# Altium schematic sheet 14_PHY_FE_41-48.SchDoc
size 419 x 296 mm; Author: Serbinov O.A.; CompanyName: ELSICOM; DrawnBy: Serbinov O.A.; Engineer: Serbinov O.A.; Organization: Elsicom; Address1: Kirova avenue, 58; Address2: Tomsk; Address3: Russia 634012; DocumentNumber: 15; SheetNumber: 15; SheetTotal: 44; ProjectName: 48_PORTS
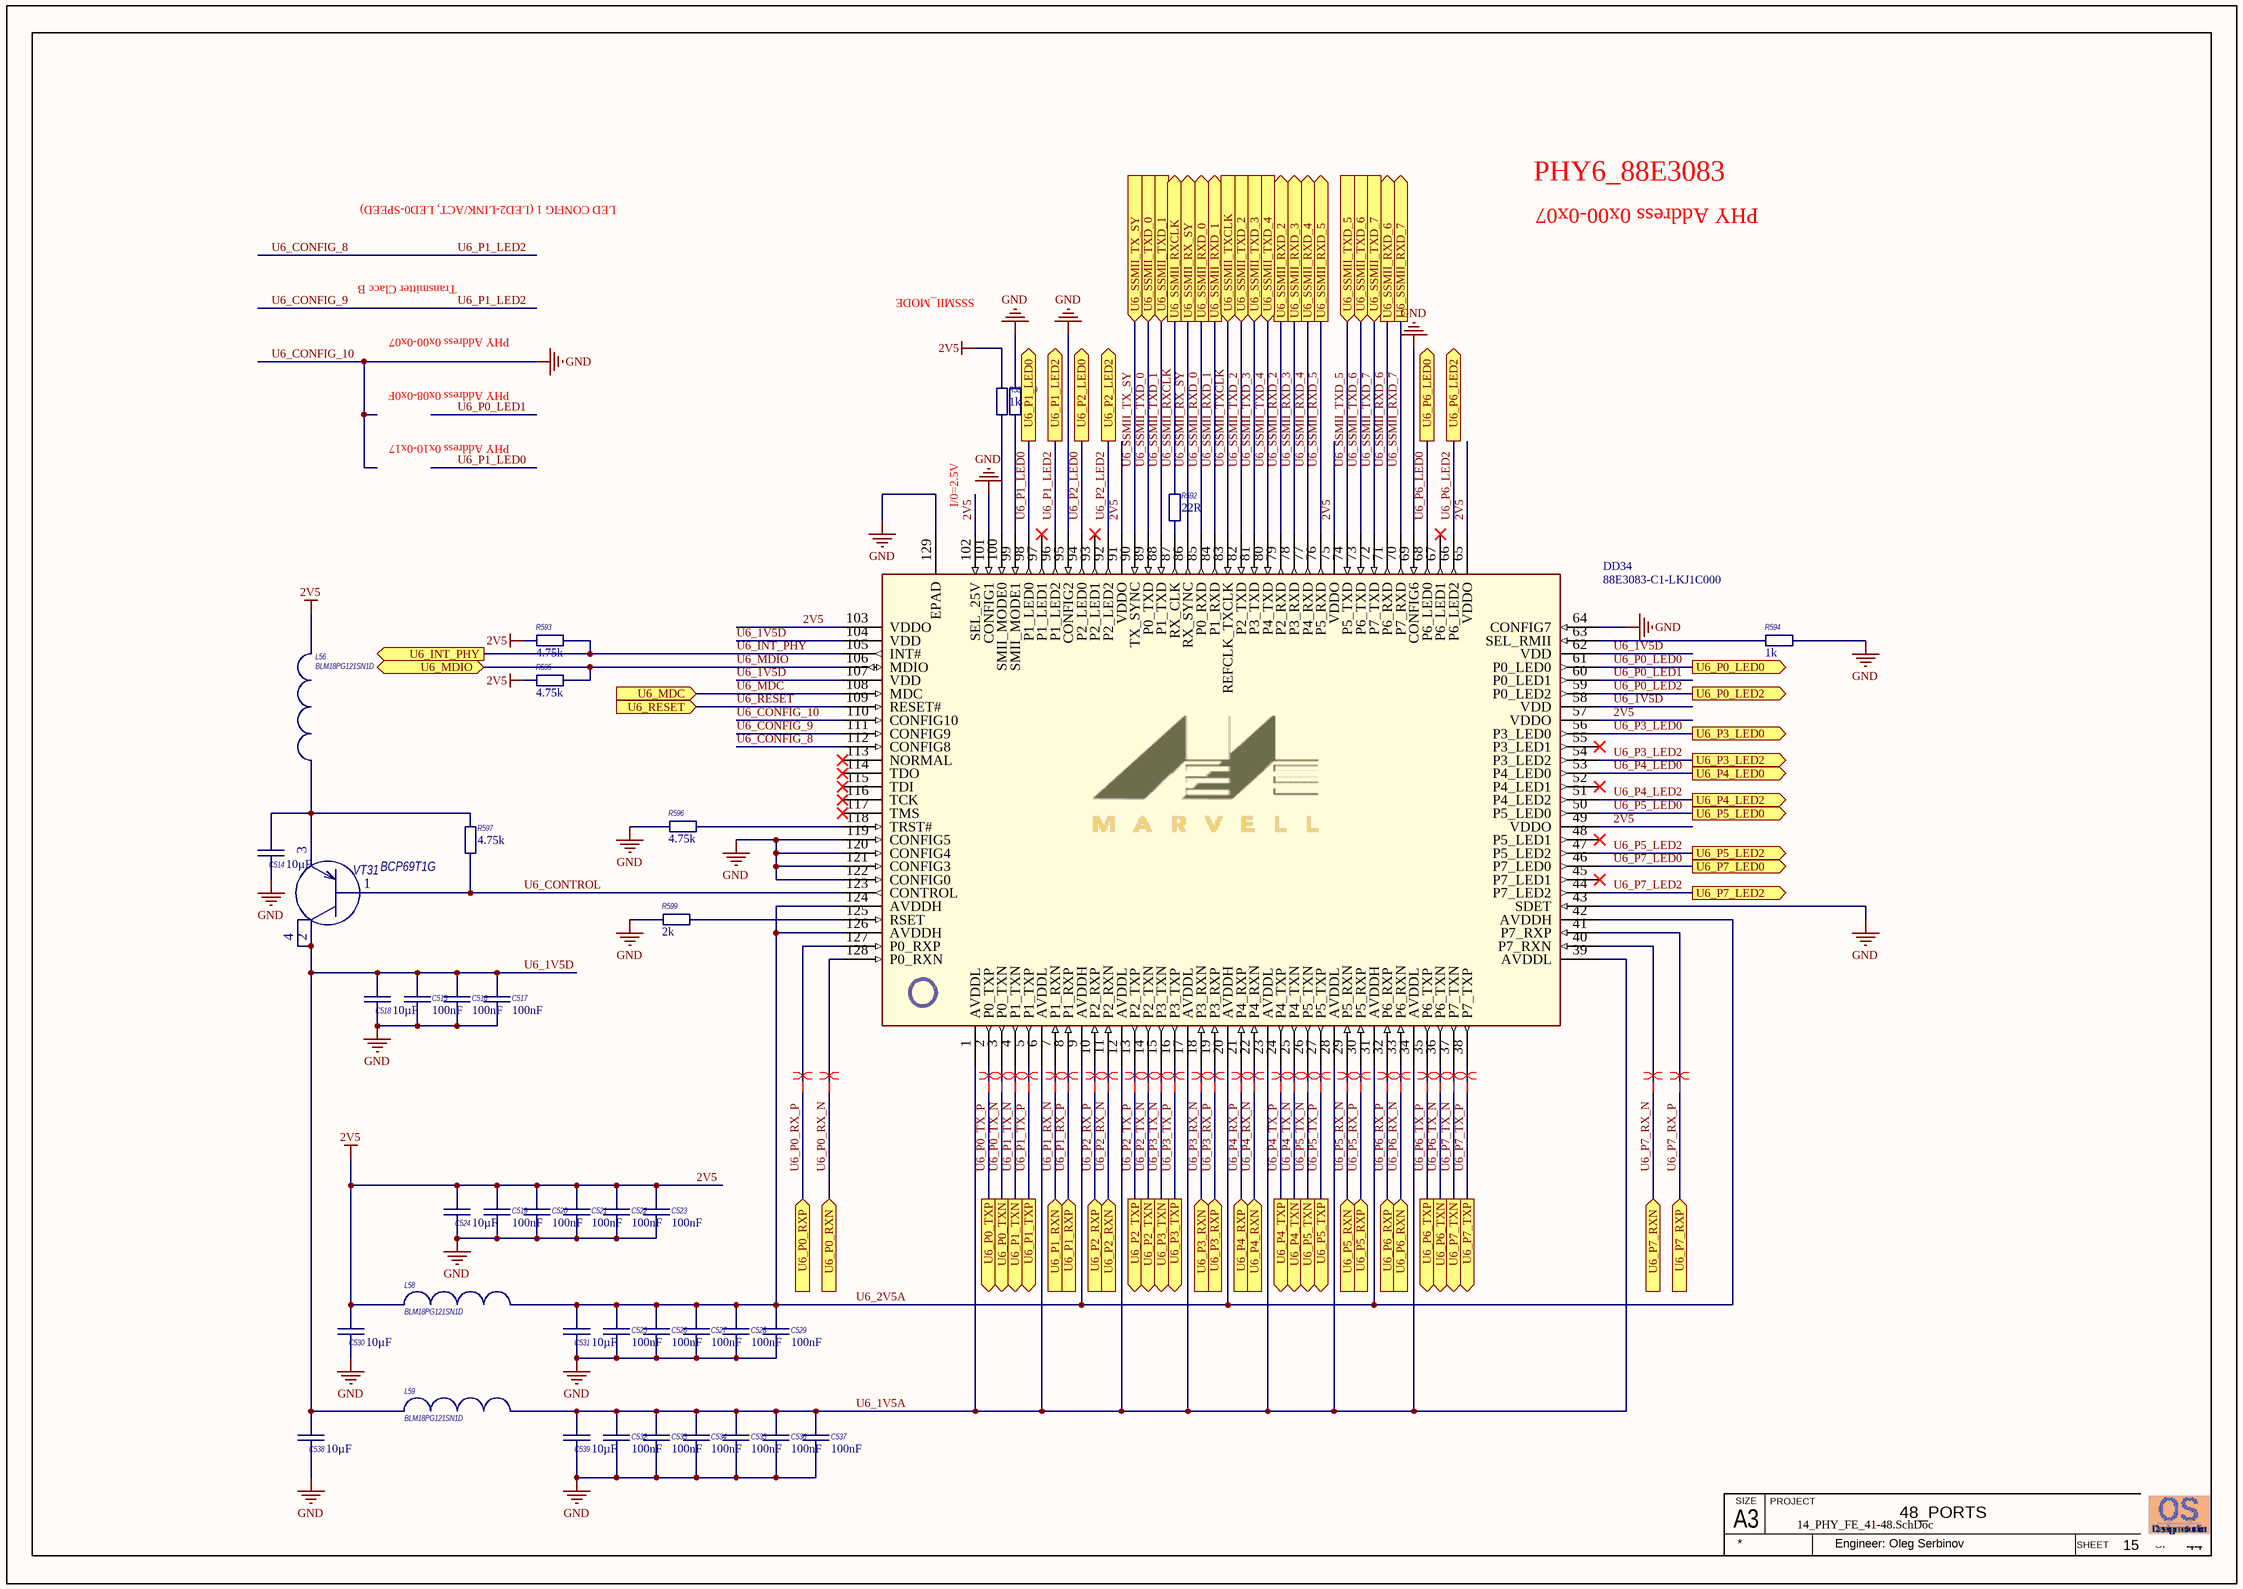
[diagram p0: 14_PHY_FE_41-48.SchDoc]

## Parts
C514  Capacitance: 10µF  [CAPC2012[0805]]  (hidden comment: GRM21BR61C106KE15)
C515  Capacitance: 100nF  [C0402_IPC High Density]  (hidden comment: GRM155R71E104KE14D)
C516  Capacitance: 100nF  [C0402_IPC High Density]  (hidden comment: GRM155R71E104KE14D)
C517  Capacitance: 100nF  [C0402_IPC High Density]  (hidden comment: GRM155R71E104KE14D)
C518  Capacitance: 10µF  [CAPC2012[0805]]  (hidden comment: GRM21BR61C106KE15)
C519  Capacitance: 100nF  [C0402_IPC High Density]  (hidden comment: GRM155R71E104KE14D)
C520  Capacitance: 100nF  [C0402_IPC High Density]  (hidden comment: GRM155R71E104KE14D)
C521  Capacitance: 100nF  [C0402_IPC High Density]  (hidden comment: GRM155R71E104KE14D)
C522  Capacitance: 100nF  [C0402_IPC High Density]  (hidden comment: GRM155R71E104KE14D)
C523  Capacitance: 100nF  [C0402_IPC High Density]  (hidden comment: GRM155R71E104KE14D)
C524  Capacitance: 10µF  [CAPC2012[0805]]  (hidden comment: GRM21BR61C106KE15)
C525  Capacitance: 100nF  [C0402_IPC High Density]  (hidden comment: GRM155R71E104KE14D)
C526  Capacitance: 100nF  [C0402_IPC High Density]  (hidden comment: GRM155R71E104KE14D)
C527  Capacitance: 100nF  [C0402_IPC High Density]  (hidden comment: GRM155R71E104KE14D)
C528  Capacitance: 100nF  [C0402_IPC High Density]  (hidden comment: GRM155R71E104KE14D)
C529  Capacitance: 100nF  [C0402_IPC High Density]  (hidden comment: GRM155R71E104KE14D)
C530  Capacitance: 10µF  [CAPC2012[0805]]  (hidden comment: GRM21BR61C106KE15)
C531  Capacitance: 10µF  [CAPC2012[0805]]  (hidden comment: GRM21BR61C106KE15)
C532  Capacitance: 100nF  [C0402_IPC High Density]  (hidden comment: GRM155R71E104KE14D)
C533  Capacitance: 100nF  [C0402_IPC High Density]  (hidden comment: GRM155R71E104KE14D)
C534  Capacitance: 100nF  [C0402_IPC High Density]  (hidden comment: GRM155R71E104KE14D)
C535  Capacitance: 100nF  [C0402_IPC High Density]  (hidden comment: GRM155R71E104KE14D)
C536  Capacitance: 100nF  [C0402_IPC High Density]  (hidden comment: GRM155R71E104KE14D)
C537  Capacitance: 100nF  [C0402_IPC High Density]  (hidden comment: GRM155R71E104KE14D)
C538  Capacitance: 10µF  [CAPC2012[0805]]  (hidden comment: GRM21BR61C106KE15)
C539  Capacitance: 10µF  [CAPC2012[0805]]  (hidden comment: GRM21BR61C106KE15)
DD34  88E3083-C1-LKJ1C000  [LQFP-128N]
L56  BLM18PG121SN1D  [INDC1608X95N]
L58  BLM18PG121SN1D  [INDC1608X95N]
L59  BLM18PG121SN1D  [INDC1608X95N]
R588  Resistance: 1k  [R0402_IPC High Density]  (hidden comment: ERJ-2RKF1001X)
R589  Resistance: 1k  [R0402_IPC High Density]  (hidden comment: ERJ-2RKF1001X)
R592  Resistance: 22R  [R0402_IPC High Density]  (hidden comment: ERJ-2RKF22R0X)
R593  Resistance (Ohms): 4.75k  [R0402_IPC High Density]  (hidden comment: ERJ-2RKF4751X)
R594  Resistance: 1k  [R0402_IPC High Density]  (hidden comment: ERJ-2RKF1001X)
R595  Resistance (Ohms): 4.75k  [R0402_IPC High Density]  (hidden comment: ERJ-2RKF4751X)
R596  Resistance (Ohms): 4.75k  [R0402_IPC High Density]  (hidden comment: ERJ-2RKF4751X)
R597  Resistance (Ohms): 4.75k  [R0402_IPC High Density]  (hidden comment: ERJ-2RKF4751X)
R599  Resistance (Ohms): 2k  [R0402_IPC High Density]  (hidden comment: ERJ-2RKF2001X)
VT31  BCP69T1G  [SOT223_N]

## Ports
U6_INT_PHY (out), U6_MDC (in), U6_MDIO (bidir), U6_P0_LED0 (out), U6_P0_LED2 (out), U6_P0_RXN (in), U6_P0_RXP (in), U6_P0_TXN (out), U6_P0_TXP (out), U6_P1_LED0 (out), U6_P1_LED2 (out), U6_P1_RXN (in), U6_P1_RXP (in), U6_P1_TXN (out), U6_P1_TXP (out), U6_P2_LED0 (out), U6_P2_LED2 (out), U6_P2_RXN (in), U6_P2_RXP (in), U6_P2_TXN (out), U6_P2_TXP (out), U6_P3_LED0 (out), U6_P3_LED2 (out), U6_P3_RXN (in), U6_P3_RXP (in), U6_P3_TXN (out), U6_P3_TXP (out), U6_P4_LED0 (out), U6_P4_LED2 (out), U6_P4_RXN (in), U6_P4_RXP (in), U6_P4_TXN (out), U6_P4_TXP (out), U6_P5_LED0 (out), U6_P5_LED2 (out), U6_P5_RXN (in), U6_P5_RXP (in), U6_P5_TXN (out), U6_P5_TXP (out), U6_P6_LED0 (out), U6_P6_LED2 (out), U6_P6_RXN (in), U6_P6_RXP (in), U6_P6_TXN (out), U6_P6_TXP (out), U6_P7_LED0 (out), U6_P7_LED2 (out), U6_P7_RXN (in), U6_P7_RXP (in), U6_P7_TXN (out), U6_P7_TXP (out), U6_RESET (in), U6_SSMII_RX_SY (out), U6_SSMII_RXCLK (out), U6_SSMII_RXD_0 (out), U6_SSMII_RXD_1 (out), U6_SSMII_RXD_2 (out), U6_SSMII_RXD_3 (out), U6_SSMII_RXD_4 (out), U6_SSMII_RXD_5 (out), U6_SSMII_RXD_6 (out), U6_SSMII_RXD_7 (out), U6_SSMII_TX_SY (in), U6_SSMII_TXCLK (in), U6_SSMII_TXD_0 (in), U6_SSMII_TXD_1 (in), U6_SSMII_TXD_2 (in), U6_SSMII_TXD_3 (in), U6_SSMII_TXD_4 (in), U6_SSMII_TXD_5 (in), U6_SSMII_TXD_6 (in), U6_SSMII_TXD_7 (in)

## Nets
2V5: C519.2 C520.2 C521.2 C522.2 C523.2 C524.2 C530.2 DD34.49(VDDO) DD34.57(VDDO) DD34.65(VDDO) DD34.75(VDDO) DD34.91(VDDO) DD34.102(SEL_25V) DD34.103(VDDO) L56.2 L58.1 R588.2 R593.1 R595.1
U6_CONFIG_10: C514.1 C515.1 C516.1 C517.1 C518.1 C519.1 C520.1 C521.1 C522.1 C523.1 C524.1 C525.1 C526.1 C527.1 C528.1 C529.1 C530.1 C531.1 C532.1 C533.1 C534.1 C535.1 C536.1 C537.1 C538.1 C539.1 DD34.43(SDET) DD34.64(CONFIG7) DD34.69(CONFIG6) DD34.95(CONFIG2) DD34.101(CONFIG1) DD34.110(CONFIG10) DD34.119(CONFIG5) DD34.120(CONFIG4) DD34.121(CONFIG3) DD34.122(CONFIG0) DD34.129(EPAD) R589.2 R594.1 R596.1 R599.1  [also labelled GND]
U6_1V5A: C532.2 C533.2 C534.2 C535.2 C536.2 C537.2 C539.2 DD34.1(AVDDL) DD34.6(AVDDL) DD34.12(AVDDL) DD34.17(AVDDL) DD34.23(AVDDL) DD34.28(AVDDL) DD34.34(AVDDL) DD34.39(AVDDL) L59.2
U6_1V5D: C515.2 C516.2 C517.2 C518.2 C538.2 DD34.58(VDD) DD34.62(VDD) DD34.104(VDD) DD34.107(VDD) L59.1 VT31.2(K) VT31.4(K)
U6_2V5A: C525.2 C526.2 C527.2 C528.2 C529.2 C531.2 DD34.9(AVDDH) DD34.20(AVDDH) DD34.31(AVDDH) DD34.42(AVDDH) DD34.124(AVDDH) DD34.126(AVDDH) L58.2
U6_CONFIG_8: DD34.96(P1_LED2) DD34.111(CONFIG9) DD34.112(CONFIG8) ; port U6_P1_LED2  [also labelled U6_CONFIG_9, U6_P1_LED2]
U6_CONTROL: DD34.123(CONTROL) R597.1 VT31.1(B)
U6_INT_PHY: DD34.105(INT#) R593.2 ; port U6_INT_PHY
U6_MDC: DD34.108(MDC) ; port U6_MDC
U6_MDIO: DD34.106(MDIO) R595.2 ; port U6_MDIO
U6_P0_LED0: DD34.61(P0_LED0) ; port U6_P0_LED0
U6_P0_LED1: DD34.60(P0_LED1)
U6_P0_LED2: DD34.59(P0_LED2) ; port U6_P0_LED2
U6_P0_RX_N: DD34.128(P0_RXN) ; port U6_P0_RXN
U6_P0_RX_P: DD34.127(P0_RXP) ; port U6_P0_RXP
U6_P0_TX_N: DD34.3(P0_TXN) ; port U6_P0_TXN
U6_P0_TX_P: DD34.2(P0_TXP) ; port U6_P0_TXP
U6_P1_LED0: DD34.98(P1_LED0) ; port U6_P1_LED0
U6_P1_RX_N: DD34.7(P1_RXN) ; port U6_P1_RXN
U6_P1_RX_P: DD34.8(P1_RXP) ; port U6_P1_RXP
U6_P1_TX_N: DD34.4(P1_TXN) ; port U6_P1_TXN
U6_P1_TX_P: DD34.5(P1_TXP) ; port U6_P1_TXP
U6_P2_LED0: DD34.94(P2_LED0) ; port U6_P2_LED0
U6_P2_LED2: DD34.92(P2_LED2) ; port U6_P2_LED2
U6_P2_RX_N: DD34.11(P2_RXN) ; port U6_P2_RXN
U6_P2_RX_P: DD34.10(P2_RXP) ; port U6_P2_RXP
U6_P2_TX_N: DD34.14(P2_TXN) ; port U6_P2_TXN
U6_P2_TX_P: DD34.13(P2_TXP) ; port U6_P2_TXP
U6_P3_LED0: DD34.56(P3_LED0) ; port U6_P3_LED0
U6_P3_LED2: DD34.54(P3_LED2) ; port U6_P3_LED2
U6_P3_RX_N: DD34.18(P3_RXN) ; port U6_P3_RXN
U6_P3_RX_P: DD34.19(P3_RXP) ; port U6_P3_RXP
U6_P3_TX_N: DD34.15(P3_TXN) ; port U6_P3_TXN
U6_P3_TX_P: DD34.16(P3_TXP) ; port U6_P3_TXP
U6_P4_LED0: DD34.53(P4_LED0) ; port U6_P4_LED0
U6_P4_LED2: DD34.51(P4_LED2) ; port U6_P4_LED2
U6_P4_RX_N: DD34.22(P4_RXN) ; port U6_P4_RXN
U6_P4_RX_P: DD34.21(P4_RXP) ; port U6_P4_RXP
U6_P4_TX_N: DD34.25(P4_TXN) ; port U6_P4_TXN
U6_P4_TX_P: DD34.24(P4_TXP) ; port U6_P4_TXP
U6_P5_LED0: DD34.50(P5_LED0) ; port U6_P5_LED0
U6_P5_LED2: DD34.47(P5_LED2) ; port U6_P5_LED2
U6_P5_RX_N: DD34.29(P5_RXN) ; port U6_P5_RXN
U6_P5_RX_P: DD34.30(P5_RXP) ; port U6_P5_RXP
U6_P5_TX_N: DD34.26(P5_TXN) ; port U6_P5_TXN
U6_P5_TX_P: DD34.27(P5_TXP) ; port U6_P5_TXP
U6_P6_LED0: DD34.68(P6_LED0) ; port U6_P6_LED0
U6_P6_LED2: DD34.66(P6_LED2) ; port U6_P6_LED2
U6_P6_RX_N: DD34.33(P6_RXN) ; port U6_P6_RXN
U6_P6_RX_P: DD34.32(P6_RXP) ; port U6_P6_RXP
U6_P6_TX_N: DD34.36(P6_TXN) ; port U6_P6_TXN
U6_P6_TX_P: DD34.35(P6_TXP) ; port U6_P6_TXP
U6_P7_LED0: DD34.46(P7_LED0) ; port U6_P7_LED0
U6_P7_LED2: DD34.44(P7_LED2) ; port U6_P7_LED2
U6_P7_RX_N: DD34.40(P7_RXN) ; port U6_P7_RXN
U6_P7_RX_P: DD34.41(P7_RXP) ; port U6_P7_RXP
U6_P7_TX_N: DD34.37(P7_TXN) ; port U6_P7_TXN
U6_P7_TX_P: DD34.38(P7_TXP) ; port U6_P7_TXP
U6_RESET: DD34.109(RESET#) ; port U6_RESET
U6_SSMII_RX_SY: DD34.86(RX_SYNC) ; port U6_SSMII_RX_SY
U6_SSMII_RXCLK: R592.2 ; port U6_SSMII_RXCLK
U6_SSMII_RXD_0: DD34.85(P0_RXD) ; port U6_SSMII_RXD_0
U6_SSMII_RXD_1: DD34.84(P1_RXD) ; port U6_SSMII_RXD_1
U6_SSMII_RXD_2: DD34.79(P2_RXD) ; port U6_SSMII_RXD_2
U6_SSMII_RXD_3: DD34.78(P3_RXD) ; port U6_SSMII_RXD_3
U6_SSMII_RXD_4: DD34.77(P4_RXD) ; port U6_SSMII_RXD_4
U6_SSMII_RXD_5: DD34.76(P5_RXD) ; port U6_SSMII_RXD_5
U6_SSMII_RXD_6: DD34.71(P6_RXD) ; port U6_SSMII_RXD_6
U6_SSMII_RXD_7: DD34.70(P7_RXD) ; port U6_SSMII_RXD_7
U6_SSMII_TX_SY: DD34.90(TX_SYNC) ; port U6_SSMII_TX_SY
U6_SSMII_TXCLK: DD34.83(REFCLK_TXCLK) ; port U6_SSMII_TXCLK
U6_SSMII_TXD_0: DD34.89(P0_TXD) ; port U6_SSMII_TXD_0
U6_SSMII_TXD_1: DD34.88(P1_TXD) ; port U6_SSMII_TXD_1
U6_SSMII_TXD_2: DD34.82(P2_TXD) ; port U6_SSMII_TXD_2
U6_SSMII_TXD_3: DD34.81(P3_TXD) ; port U6_SSMII_TXD_3
U6_SSMII_TXD_4: DD34.80(P4_TXD) ; port U6_SSMII_TXD_4
U6_SSMII_TXD_5: DD34.74(P5_TXD) ; port U6_SSMII_TXD_5
U6_SSMII_TXD_6: DD34.73(P6_TXD) ; port U6_SSMII_TXD_6
U6_SSMII_TXD_7: DD34.72(P7_TXD) ; port U6_SSMII_TXD_7
NetC514_2: C514.2 L56.1 R597.2 VT31.3(E)
NetDD34_63: DD34.63(SEL_RMII) R594.2
NetDD34_87: DD34.87(RX_CLK) R592.1
NetDD34_99: DD34.99(SMII_MODE1) R589.1
NetDD34_100: DD34.100(SMII_MODE0) R588.1
NetDD34_118: DD34.118(TRST#) R596.2
NetDD34_125: DD34.125(RSET) R599.2

Not connected (* = marked no-connect by the designer): DD34 45(P7_LED1)* 48(P5_LED1)* 52(P4_LED1)* 55(P3_LED1)* 67(P6_LED1)* 93(P2_LED1)* 97(P1_LED1)* 113(NORMAL)* 114(TDO)* 115(TDI)* 116(TCK)* 117(TMS)*

## Layout directives
differential pair: U6_P0_RX_N, U6_P0_RX_P, U6_P0_TX_N, U6_P0_TX_P, U6_P1_RX_N, U6_P1_RX_P, U6_P1_TX_N, U6_P1_TX_P, U6_P2_RX_N, U6_P2_RX_P, U6_P2_TX_N, U6_P2_TX_P, U6_P3_RX_N, U6_P3_RX_P, U6_P3_TX_N, U6_P3_TX_P, U6_P4_RX_N, U6_P4_RX_P, U6_P4_TX_N, U6_P4_TX_P, U6_P5_RX_N, U6_P5_RX_P, U6_P5_TX_N, U6_P5_TX_P, U6_P6_RX_N, U6_P6_RX_P, U6_P6_TX_N, U6_P6_TX_P, U6_P7_RX_N, U6_P7_RX_P, U6_P7_TX_N, U6_P7_TX_P

## Notes on the sheet
- PHY6_88E3083
- LED CONFIG 1 (LED2-LINK/ACT, LED0-SPEED)
- PHY Address 0x00-0x07
- Transmitter Clacc B
- SSSMII_MODE
- PHY Address 0x08-0x0F
- PHY Address 0x10-0x17
- I/0=2.5V
- A3
- SIZE
- PROJECT
- SHEET
- OF
- Engineer: Oleg Serbinov

## Library data of the parts
C514 C518 C524 C530 C531 C538 C539 = GRM21BR61C106KE15: C0805, 10uF 10%, 16V, X5R; Manufacturer: Murata; Customer Part Number: Конденсатор, 10u, 0805, 16V, X5R, 10%; Analogs: any suitable; Applications: General Purpose; Category: Capacitors; Operating Temperature: -55°C ~ 85°C; Package / Case: 0805 (2012 Metric); Size / Dimension: 0.079" L x 0.049" W (2.00mm x 1.25mm); Temperature Coefficient: X5R; Tolerance: ±10%; ComponentLink1URL: http://search.murata.co.jp/Ceramy/image/img/PDF/ENG/GRM21BR61C106KE15.pdf; ComponentLink1Description: http://search.murata.co.jp/Ceramy/image/img/PDF/ENG/GRM21BR61C106KE15.pdf; Pricing: 1=0.3, 10=0.25, 50=0.1408, 100=0.1252, 250=0.09392, 500=0.08294, 1000=0.07356 (USD); Voltage - Rated: 16V; Manufacturer Part Number: GRM21BR61C106KE15
C515-C517 C519-C523 C525-C529 C532-C537 = GRM155R71E104KE14D: C0402, 100nF, 25V, X7R; Manufacturer: Murata; Rmanufacturer: Yageo  Samsung  TDK  Taiyo Yuden  Kemet; Customer Part Number: Конденсатор, 100n, 0402, 25V, X7R, 10%; Capacitance Tolerance: ± 10%; Voltage Rating: 16; Capacitor Case Style: 0402 [1005 Metric]; Capacitor Terminals: SMD; SVHC: No SVHC (19-Dec-2012); No. of Pins: 2; Reel Quantity: 10000; Tolerance +: 10%; Analogs: any suitable; Supplier 1: Farnell; Supplier Part Number 1: 1118151; Manufacturer Part Number: GRM155R71E104KE14D; RoHS: YES; Stock: 3; Pricing: 10000=0.008593, 30000=0.007991 (GBP); Dielectric Characteristic: X7R; Operating Temperature Min: -55; Operating Temperature Max: 125; Operating Temperature Range: -55°C to +125; Package / Case: 0402; Packaging: Reel; Series: GRM Hi-Cap; Terminal Type: Surface Mount (SMD, SMT); Tolerance -: 10%; Voltage Rating V DC: 16; ComponentLink1URL: http://www.farnell.com/datasheets/4360.pdf; ComponentLink1Description: http://www.farnell.com/datasheets/4360.pdf
DD34 = 88E3083-C1-LKJ1C000: IC 10/100BASE-T OCTAL PHY; Customer Part Number: Микросхема, 88E3083-C1-LKJ1C000, IC 10/100BASE-T OCTAL PHY, 128 LQFP; Manufacturer: Marvell Technology Group; Manufacturer Part Number: 88E3083-C1-LKJ1C000
L56 L58 L59 = BLM18PG121SN1D: FILTER BLM18 (0603, 2A); Manufacturer: Murata; Rpart number: MPZ1608S121ATAH0 ; CIC10P121NC ; MPZ1608S121ATDH5 ; BLM18PG121SH1D ; 742792625; Rmanufacturer: Boruns  Samsung  TDK  Murata  Wurth Electronics; Customer Part Number: Дроссель, BLM18PG121SN1D, FERRITE BEAD 120 OHM 1LN, 0603; DC Resistance Max: 0.05; Impedance: 120; Ferrite Mounting: SMD; Inductor Type: Ferrite Bead; SVHC: No SVHC (19-Dec-2011); Ferrite Case Style: 0603 / 1608; Core Material: Ferrite; DC Current Max: 2000; Inductor Case Style: 0603; Inductance Tolerance: ± 25%; No. of Pins: 2; RoHS: YES; Operating Temperature Min: -55; Mounting Type: SMD; Operating Temperature Max: +125; Package / Case: 0603; Impedance @ 100MHz Typ: 120; Resistance: 0.05; Supplier Part Number: 1515738; Supplier: Farnell; ComponentLink1URL: http://www.farnell.com/datasheets/5148.pdf; ComponentLink1Description: http://www.farnell.com/datasheets/5148.pdf; Pricing: 5=0.056, 50=0.041, 100=0.034, 250=0.028, 500=0.027 (GBP); Manufacturer Part Number: BLM18PG121SN1D; DC Current Rating: 2A; Analogs: MPZ1608S121ATAH0 ; CIC10P121NC ; MPZ1608S121ATDH5 ; BLM18PG121SH1D ; 742792625
R588 R589 R594 = ERJ-2RKF1001X: R0402, 1k 1%; Manufacturer: Panasonic; Rpart number: RC0402FR-071KL ; RC1005F102CS ; RMCF0402FT1K00 ; MCR01MRTF1001 ; CRCW04021K00FKED ; ERJ2RKF1001X; Rmanufacturer: Yageo  Samsung  Stackpole Electronics  Rohm Semiconductor  Vishay Dale; Customer Part Number: Резистор, 1K, 0402, 1%; Temperature Coefficient: 100 PPM / C; Power Rating: 100 mWatts; Voltage Rating: 50 Volts; Analogs: any suitable; Supplier: Mouser; Termination Style: SMD/SMT; Series: ERJ; Supplier Part Number: 667-ERJ-2RKF1001X; RoHS: RoHS Compliant By Exemption; Dimensions: 0.5 mm W x 1 mm L x 0.35 mm H; Package / Case: 0402 (1005 metric); Product Category: .; Manufacturer Part Number: ERJ-2RKF1001X; Packaging: Reel; Tolerance: 1 %; Operating Temperature Range: - 55 C to + 155 C; Category: Thick Film Resistors - SMD; Product: Thick Film Resistors SMD; Reeling: True; Minimum Order Quantity: 1; RoHS - Mouser: E; Standard Pack Qty: 10000; ComponentLink1URL: http://industrial.panasonic.com/www-data/pdf/AOA0000/AOA0000CE2.pdf; ComponentLink1Description: http://industrial.panasonic.com/www-data/pdf/AOA0000/AOA0000CE2.pdf; Pricing: 1=0.135, 25=0.032, 100=0.024, 250=0.018, 500=0.014, 1000=0.008, 2000=0.007, 5000=0.004 (AUD)
R592 = ERJ-2RKF22R0X: R0402, 22R 1%; Manufacturer: Panasonic; Rpart number: RC0402FR-0749R9L ; RC1005F49R9CS ; MCR01MRTF49R9 ; CRCW040249R9FKED ; CR0402-FX-49R9GLF ; RC-02W220FT; Rmanufacturer: Yageo  Samsung  Stackpole Electronics  Rohm Semiconductor  Vishay Dale; Customer Part Number: Резистор, 22R, 0402, 1%; Power Rating: 100; Voltage Rating: 50; Temperature Coefficient: ± 100; Resistor Element Material: Thick Film; Resistor Case Style: 0402; Resistor Mounting: SMD; Analogs: any suitable; Supplier 1: Farnell; Supplier Part Number 1: 2059106; RoHS 1: YES; Stock 1: 10948; Pricing 1: 50=0.016, 100=0.012, 500=0.006, 1000=0.004 (GBP); Resistance Tolerance: ± 1%; ComponentLink1URL: http://www.farnell.com/datasheets/426256.pdf; ComponentLink1Description: http://www.farnell.com/datasheets/426256.pdf; Supplier: Farnell; RoHS: YES; Manufacturer Part Number: ERJ-2RKF22R0X; Supplier Part Number: 2059106; Pricing: 50=0.016, 100=0.012, 500=0.006, 1000=0.004 (GBP)
R593 R595-R597 = ERJ-2RKF4751X: R0402, 4.75k 1%; Manufacturer: Panasonic; Rpart number: RC0402FR-074K75L ; RC1005F4751CS ; RMCF0402FT4K75 ; CRCW04024K75FKED ; TRR01MZPF4751; Rmanufacturer: Yageo  Samsung  Stackpole Electronics  Rohm Semiconductor  Vishay Dale; Customer Part Number: Резистор, 4K75, 0402, 1%; Temperature Coefficient: ±100ppm/°C; Power (Watts): 0.1W, 1/10W; Analogs: any suitable; Tolerance: ±1%; Packaging: Cut Tape (CT); Package / Case: 0402 (1005 Metric); Category: Resistors; Manufacturer Part Number: ERJ-2RKF4751X; Supplier Part Number: P4.75KLCT-ND; RoHS: RoHS Compliant; Supplier: Digi-Key; ComponentLink1URL: http://industrial.panasonic.com/www-cgi/jvcr13pz.cgi?E+PZ+3+AOA0002+ERJ2RKF4751X+7+WW; ComponentLink1Description: http://industrial.panasonic.com/www-cgi/jvcr13pz.cgi?E+PZ+3+AOA0002+ERJ2RKF4751X+7+WW; Features: -; Composition: Thick Film; Height: 0.016" (0.40mm); Number of Terminations: 2; Supplier Device Package: 0402; Size / Dimension: 0.039" L x 0.020" W (1.00mm x 0.50mm)
R599 = ERJ-2RKF2001X: R0402, 2k 1%; Manufacturer: Panasonic; Customer Part Number: Резистор, 2K, 0402, 1%; Temperature Coefficient: ±100ppm/°C; Power (Watts): 0.1W, 1/10W; Analogs: any suitable; Tolerance: ±1%; Package / Case: 0402 (1005 Metric); Features: -; Height: 0.016" (0.40mm); Size / Dimension: 0.039" L x 0.020" W (1.00mm x 0.50mm); Category: Resistors; Supplier: Digi-Key; Composition: Thick Film; RoHS: RoHS Compliant; Supplier Part Number: P2.00KLTR-ND; Manufacturer Part Number: ERJ-2RKF2001X; Packaging: Tape & Reel (TR); Number of Terminations: 2; ComponentLink1URL: http://industrial.panasonic.com/www-cgi/jvcr13pz.cgi?E+PZ+3+AOA0002+ERJ2RKF2001X+7+WW; ComponentLink1Description: http://industrial.panasonic.com/www-cgi/jvcr13pz.cgi?E+PZ+3+AOA0002+ERJ2RKF2001X+7+WW; Pricing: 10000=0.00347, 30000=0.00305, 50000=0.00279, 100000=0.00274 (USD)
VT31 = BCP69T1: TRANSISTOR PNP -20V -1A SOT-223; Manufacturer: ON Semiconductor; Rpart number: FZT549TA; Rmanufacturer: Diodes Incorporated; Customer Part Number: Транзистор, BCP69T1G, TRANS PNP 20V 1A, SOT-223; Description 1: Transistors Bipolar - BJT 1A 20V PNP; Category 1: Transistors Bipolar - BJT; Collector- Emitter Voltage VCEO Max: 20 V; Configuration: Single; Emitter- Base Voltage VEBO: 5 V; Power Dissipation: 1.5 W; DC Collector/Base Gain hfe Min: 50 at 5 mA at 10 V; Maximum DC Collector Current: 1 A; Maximum Operating Frequency: 60 MHz; Product Status: Obsolete; Supplier 1: Mouser; Supplier Part Number 1: 863-BCP69T1; RoHS 1: RoHS Compliant; Stock 1: 0; Package / Case: SOT-223-4; Packaging: Reel; Continuous Collector Current: - 1 A; Mounting Style: SMD/SMT; Transistor Polarity: PNP; Maximum Operating Temperature: + 150 C; Minimum Operating Temperature: - 65 C; Product Category: Transistors Bipolar- General Purpose; Standard Pack Qty: 1000; RoHS - Mouser: N; Minimum Order Quantity: 1; Reeling: True; ComponentLink1URL: http://www.onsemi.com/pub/Collateral/BCP69T1-D.PDF; ComponentLink1Description: http://www.onsemi.com/pub/Collateral/BCP69T1-D.PDF; RoHS: RoHS Compliant; Supplier Part Number: 863-BCP69T1; Manufacturer Part Number: BCP69T1; Supplier: Mouser; Category: Transistors Bipolar - BJT; Analogs: FZT549TA